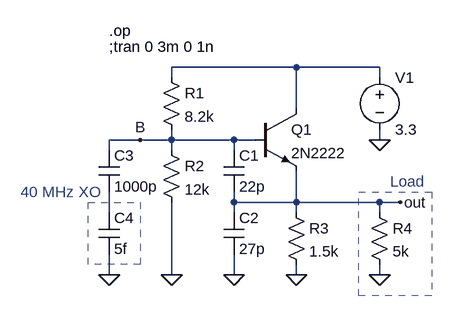
[diagram p0: schematic Colpitts_40MHz_com_coll.asc]
Colpitts_40MHz_com_coll.asc, the LTspice schematic file:
Version 4
SHEET 1 880 680
WIRE 320 0 128 0
WIRE 448 0 320 0
WIRE 128 16 128 0
WIRE 448 16 448 0
WIRE 320 64 320 0
WIRE 80 112 32 112
WIRE 128 112 128 96
WIRE 128 112 80 112
WIRE 224 112 128 112
WIRE 256 112 224 112
WIRE 448 112 448 96
WIRE 32 128 32 112
WIRE 128 128 128 112
WIRE 224 128 224 112
WIRE 224 208 224 192
WIRE 320 208 320 160
WIRE 320 208 224 208
WIRE 448 208 320 208
WIRE 480 208 448 208
WIRE 32 224 32 192
WIRE 224 224 224 208
WIRE 320 224 320 208
WIRE 448 224 448 208
WIRE 32 320 32 288
WIRE 128 320 128 208
WIRE 224 320 224 288
WIRE 320 320 320 304
WIRE 448 320 448 304
FLAG 128 320 0
FLAG 320 320 0
FLAG 448 112 0
FLAG 224 320 0
FLAG 480 208 out
FLAG 32 320 0
FLAG 448 320 0
FLAG 80 112 B
SYMBOL npn 256 64 R0
SYMATTR InstName Q1
SYMATTR Value 2N2222
SYMBOL res 112 0 R0
SYMATTR InstName R1
SYMATTR Value 8.2k
SYMBOL res 112 112 R0
SYMATTR InstName R2
SYMATTR Value 12k
SYMBOL res 304 208 R0
SYMATTR InstName R3
SYMATTR Value 1.5k
SYMBOL voltage 448 0 R0
WINDOW 123 0 0 Left 2
WINDOW 39 0 0 Left 2
SYMATTR Value2 ""
SYMATTR SpiceLine ""
SYMATTR InstName V1
SYMATTR Value 3.3
SYMBOL cap 208 128 R0
SYMATTR InstName C1
SYMATTR Value 22p
SYMBOL cap 208 224 R0
SYMATTR InstName C2
SYMATTR Value 27p
SYMBOL cap 16 128 R0
SYMATTR InstName C3
SYMATTR Value 1000p
SYMBOL cap 16 224 R0
SYMATTR InstName C4
SYMATTR Value 5f
SYMATTR SpiceLine Rser=40 Lser=3.16m Rpar=100meg Cpar=2.5p
SYMBOL res 432 208 R0
SYMATTR InstName R4
SYMATTR Value 5k
TEXT 32 -32 Left 2 !;tran 0 3m 0 1n
TEXT 32 -56 Left 2 !.op
TEXT 464 176 Left 2 ;Load
TEXT -104 192 Left 2 ;40 MHz XO
RECTANGLE Normal 80 304 0 208 2
RECTANGLE Normal 528 352 416 192 2

The netlist it stands for:
* Colpitts_40MHz_com_coll.asc
Q1 N001 B out 0 2N2222
R1 N001 B 8.2k
R2 B 0 12k
R3 out 0 1.5k
V1 N001 0 3.3
C1 B out 22p
C2 out 0 27p
C3 B N002 1000p
C4 N002 0 5f Rser=40 Lser=3.16m Rpar=100meg Cpar=2.5p
R4 out 0 5k
.model NPN NPN
.model PNP PNP
.lib standard.bjt
;tran 0 3m 0 1n
.op
* Load
* 40 MHz XO
.backanno
.end